# Altium schematic sheet lab_1_lyaptsev_usb_spi.SchDoc: =title_line_1 + title_line_2
size 420 x 297 mm; SheetNumber: 1; SheetTotal: 1
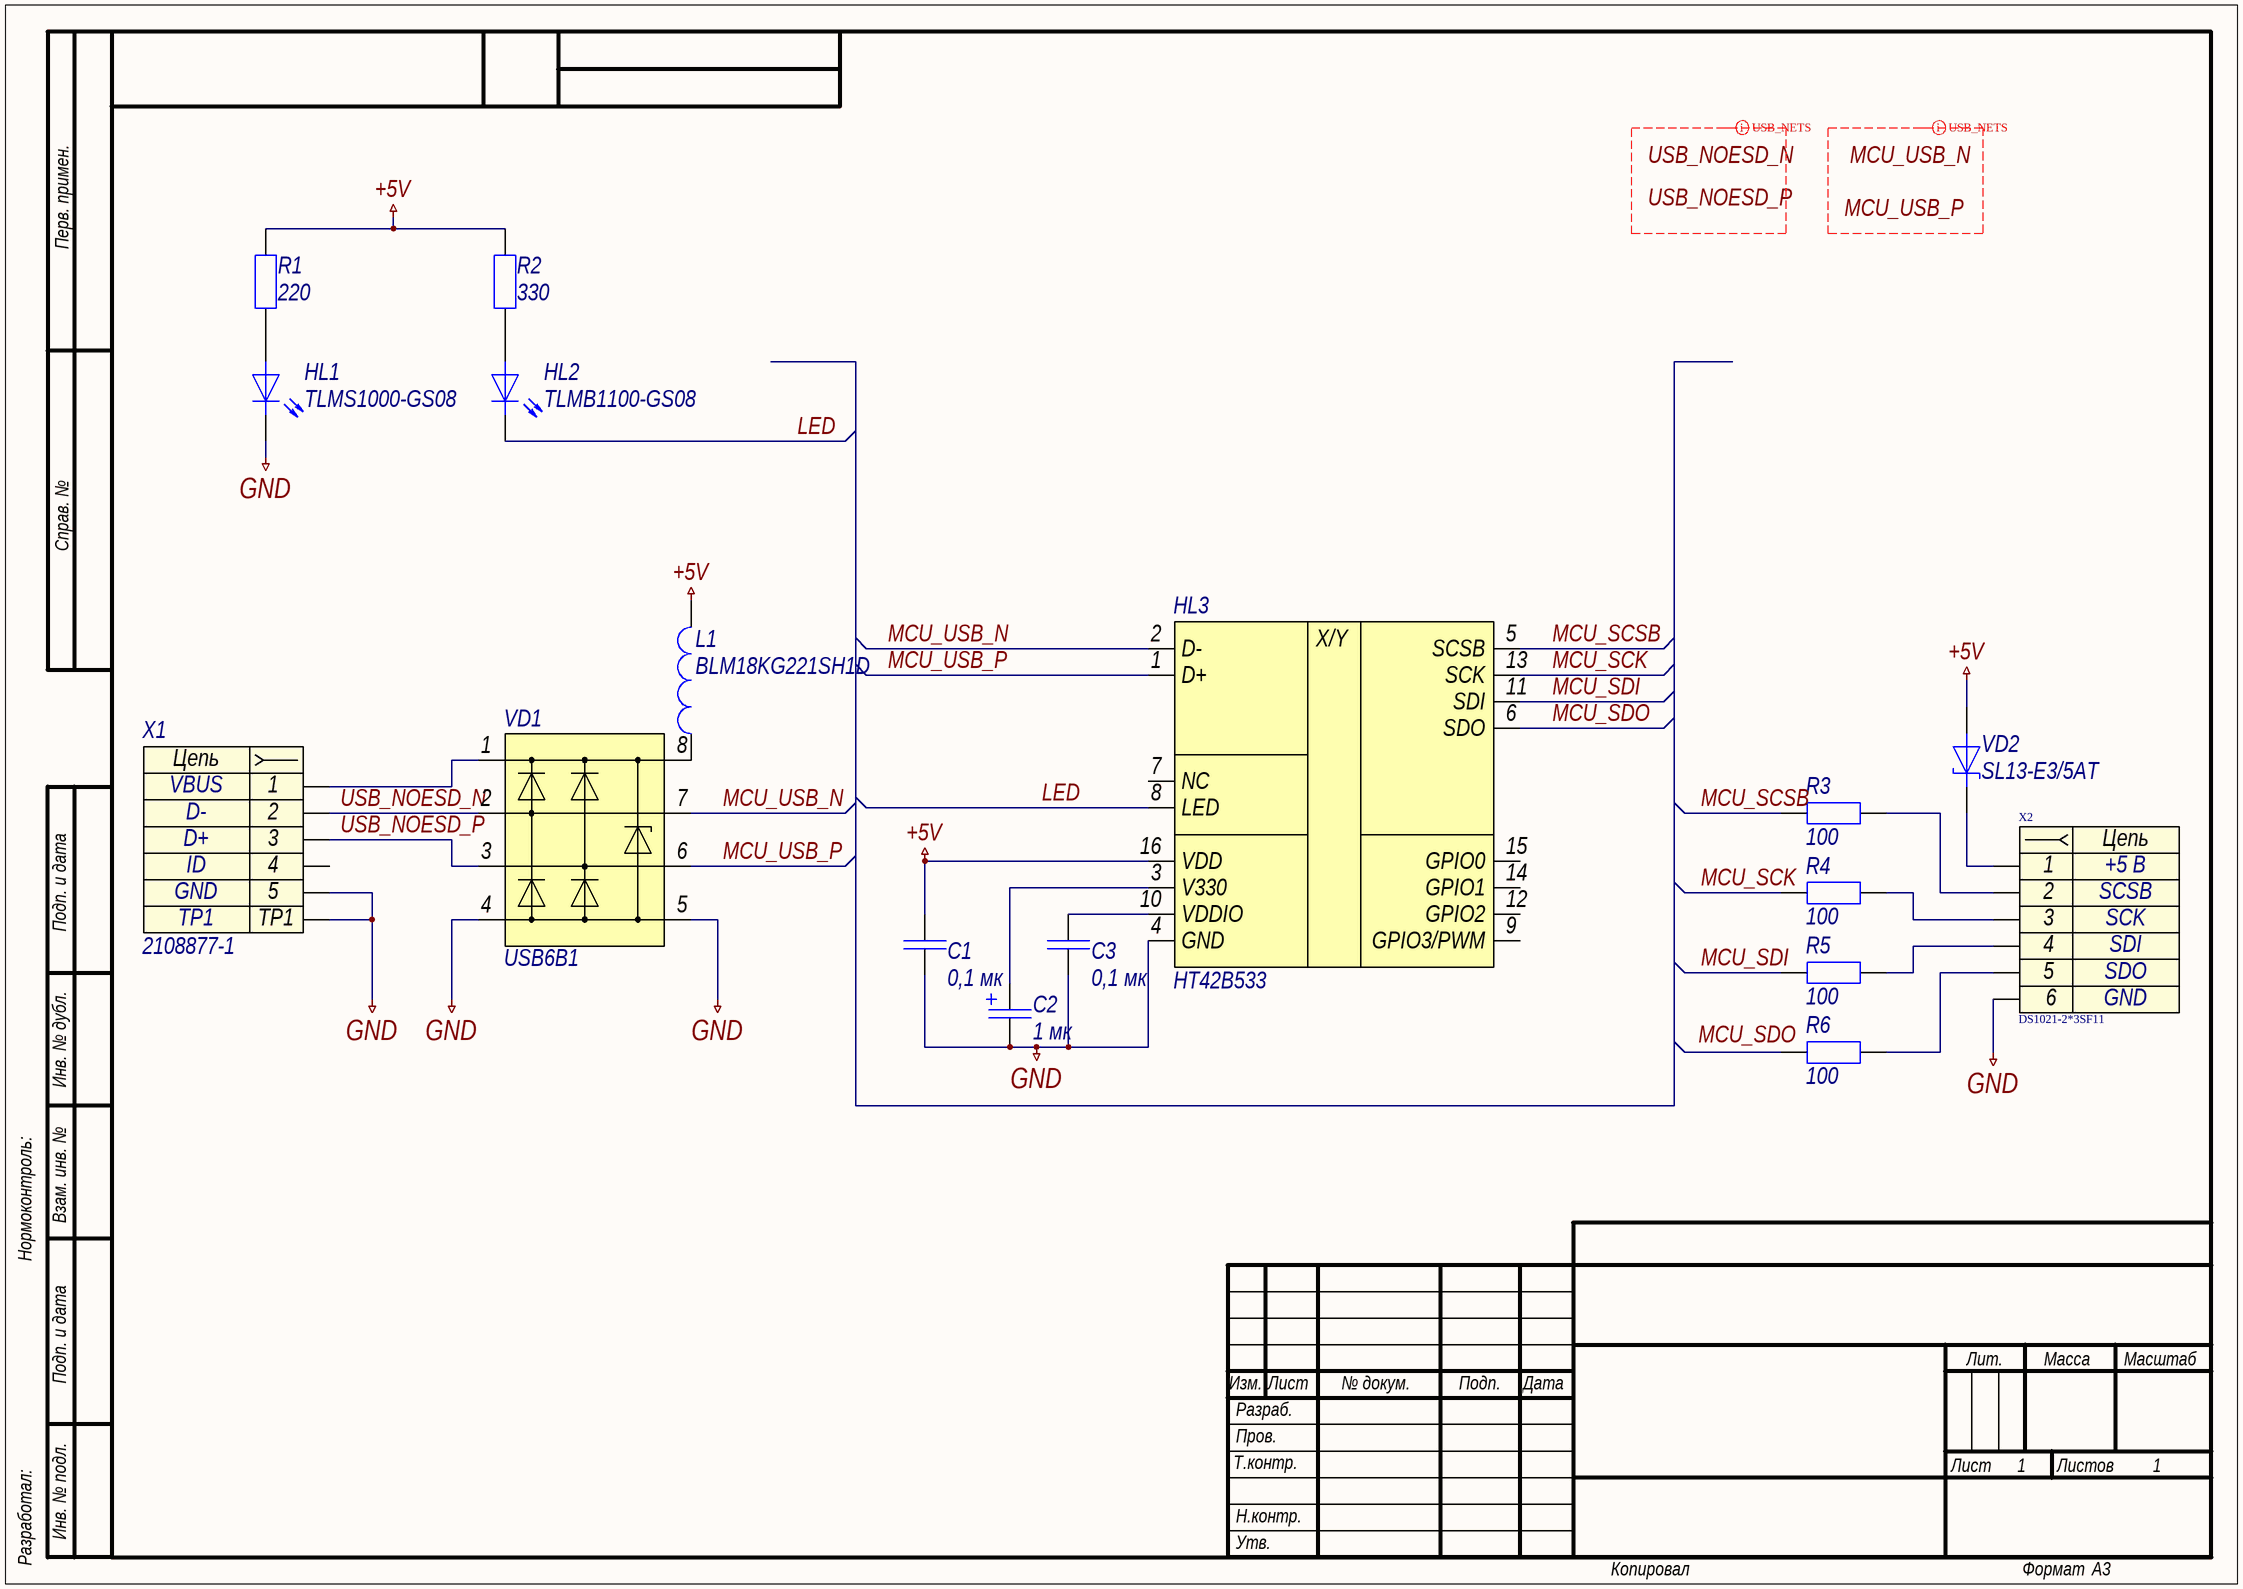
[diagram p0: lab_1_lyaptsev_usb_spi.SchDoc]

## Parts
C1  0,1 мк  [C0603]
C2  1 мк  [C1206POLAR]
C3  0,1 мк  [C0603]
HL1  TLMS1000-GS08  [HL0603]
HL2  TLMB1100-GS08  [HL0603]
HL3  HT42B533  [HT42B5-33]
L1  BLM18KG221SH1D  [FERRITE-BEAD]
R1  220  [R0603]
R2  330  [R0603]
R3  100  [R0603]
R4  100  [R0603]
R5  100  [R0603]
R6  100  [R0603]
VD1  USB6B1  [SO-8]
VD2  SL13-E3/5AT  [DO-214AC]
X1  2108877-1  [2108877-1]
X2  DS1021-2*3SF11  [PLS-2,54-2X3-THT-V]

## Nets
+5V: C1.2 HL3.16(VDD) L1.2 R1.2 R2.1 VD2.2
GND: C1.1 C2.2 C3.1 HL1.1 HL3.4(GND) VD1.4 VD1.5 X1.5 X1.TP1 X2.6
LED: HL2.1 HL3.8(LED)
MCU_SCK: HL3.13(SCK) R4.1
MCU_SCSB: HL3.5(SCSB) R3.1
MCU_SDI: HL3.11(SDI) R5.1
MCU_SDO: HL3.6(SDO)
MCU_USB_N: HL3.2(D-) VD1.7
MCU_USB_P: HL3.1(D+) VD1.6
USB_NOESD_N: VD1.2 X1.2
USB_NOESD_P: VD1.3 X1.3
NetC2_1: C2.1 HL3.3(V330)
NetC3_2: C3.2 HL3.10(VDDIO)
NetHL1_2: HL1.2 R1.1
NetHL2_2: HL2.2 R2.2
NetL1_1: L1.1 VD1.8
NetR3_2: R3.2 X2.2
NetR4_2: R4.2 X2.3
NetR5_2: R5.2 X2.4
NetR6_2: R6.2 X2.5
NetVD1_1: VD1.1 X1.1
NetVD2_1: VD2.1 X2.1

Not connected (* = marked no-connect by the designer): HL3 7(NC) 9(GPIO3/PWM) 12(GPIO2) 14(GPIO1) 15(GPIO0); R6 1; X1 4

## Layout directives
differential pair; rule Differential Pairs Routing [Pref Gap = 0.254mm    Min Gap  = 0.15mm    Max Gap  = 0.254mmPref Width = 0.381mm    Min Width  = 0.155mm    Max Width  = 0.381mm]; differential pair class USB_SIGNALS: MCU_USB_N, MCU_USB_P
differential pair; rule Differential Pairs Routing [Pref Gap = 0.254mm    Min Gap  = 0.15mm    Max Gap  = 0.254mmPref Width = 0.381mm    Min Width  = 0.155mm    Max Width  = 0.381mm]; differential pair class USB_SIGNALS_NOESD: USB_NOESD_N, USB_NOESD_P

## Notes on the sheet
- Labels drawn without touching a wire or pin: MCU_SDO, MCU_USB_N, MCU_USB_P, USB_NOESD_N, USB_NOESD_P
- Перв. примен.
- Справ. №
- Подп. и дата
- Инв. № дубл.
- Нормоконтроль:
- Взам. инв. №
- Изм.
- Лист
- № докум.
- Подп.
- Дата
- Лит.
- Масса
- Масштаб
- Т.контр.
- Пров.
- Разраб.
- Листов
- Разработал:
- Инв. № подл.
- Н.контр.
- Утв.
- Копировал
- Формат
- А3
- (in symbol dd0003) X/Y
- (in symbol x0001) Цепь
- (in symbol x0003) Цепь

## Library data of the parts
C1 C3 = c0002: =Описание; ID: c0002; Фамилия: Ларионов; Описание: Конденсатор чип 0603 0,1 мкФ 50 В ±5 %; Наименование: CC0603JRX7R9BB104; Производитель: Yageo; Отклонение: ±5 %; Номинальное напряжение: 50 В; Рабочие температуры: от -55 °С до +125 °С; Корпус: 0603; Номинал: 0,1 мк; HelpURL: https://www.yageo.com/upload/media/product/products/datasheet/mlcc/UPY-GPHC_X7R_6.3V-to-50V_20.pdf
C2 = c0008: =Описание; ID: c0008; Фамилия: Ларионов; Описание: Конденсатор чип 1206 1 мкФ 25 В ±10 % полярный; Наименование: 293D105X9025A2TE3; Производитель: Vishay Intertechnology, Inc.; Отклонение: ±10 %; Номинальное напряжение: 25 В; Рабочие температуры: от -55 °С до +125 °С; Корпус: 1206; Номинал: 1 мк; HelpURL: https://www.vishay.com/capacitors/list/product-40002/
HL1 = hl0001: =Описание; ID: hl0001; Фамилия: Ларионов; Описание: Светодиод чип 0603 красный; Производитель: Vishay Intertechnology, Inc.; Цвет: Red; Номинальная сила света: 4 мкд; Номинальная длина волны: 628 нм; Номинальный прямой ток: 15 мА; Номинальное падение напряжения: 1,8 В; Рассеиваемая мощность: 40 мВт; Рабочие температуры: от -40 °С до +100 °С; Корпус: 0603; Наименование: TLMS1000-GS08; HelpURL: https://www.vishay.com/leds/list/product-83172/
HL2 = hl0006: =Описание; ID: hl0006; Фамилия: Ларионов; Описание: Светодиод чип 0603 синий; Производитель: Vishay Intertechnology, Inc.; Цвет: Blue; Номинальная сила света: 5 мкд; Номинальная длина волны: 466 нм; Номинальный прямой ток: 30 мА; Номинальное падение напряжения: 3,9 В; Рассеиваемая мощность: 90 мВт; Рабочие температуры: от -40 °С до +100 °С; Корпус: 0603; Примечание: Not for new design; Наименование: TLMB1100-GS08; HelpURL: https://www.vishay.com/leds/list/product-83173/
HL3 = dd0003: =Описание; ID: dd0003; Фамилия: Ляпцев; Описание: Микросхема HT42B533; Производитель: Holtec; Наименование: HT42B533; Корпус: HT42B533; HelpURL: https://www.holtek.com/documents/10179/116711/HT42B533-xv120.pdf
L1 = l0001: =Описание; ID: l0001; Фамилия: Ларионов; Описание: Ферритовая бусина 220 Ом ±25 %; Производитель: Murata Manufacturing Co., Ltd.; Сопротивление, 100 МГц: 220 Ом; Отклонение, 100 Мгц: ±25 %; Сопротивление при постоянном токе: 0,05 Ом; Рабочие температуры: от -55 °С до +125 °С; Корпус: 0603; Наименование: BLM18KG221SH1D; HelpURL: https://www.murata.com/en-global/products/productdetail.aspx?partno=BLM18KG221SH1%23
R1 = r0005: =Описание; ID: r0005; Фамилия: Ларионов; Описание: Резистор чип 0603 220 Ом ±1 % 0,1 Вт; Наименование: RC0603FR-07220RL; Производитель: Yageo; Отклонение: ±1 %; Номинальное напряжение: 75 В; Рабочие температуры: от -55 °С до +155 °С; Номинальный ток: 1 А; Корпус: 0603; Номинал: 220; HelpURL: https://www.yageo.com/upload/media/product/productsearch/datasheet/rchip/PYu-RC_Group_51_RoHS_L_11.pdf
R2 = r0006: =Описание; ID: r0006; Фамилия: Ларионов; Описание: Резистор чип 0603 330 Ом ±1 % 0,1 Вт; Наименование: RC0603FR-07330RL; Производитель: Yageo; Отклонение: ±1 %; Номинальное напряжение: 75 В; Рабочие температуры: от -55 °С до +155 °С; Номинальный ток: 1 А; Корпус: 0603; Номинал: 330; HelpURL: https://www.yageo.com/upload/media/product/productsearch/datasheet/rchip/PYu-RC_Group_51_RoHS_L_11.pdf
R3-R6 = r0004: =Описание; ID: r0004; Фамилия: Самарин; Описание: Резистор чип 0603 100 Ом ±1 % 0,1 Вт; Наименование: RC0603FR‍‐07100RL; Производитель: Yageo; Отклонение: ±1 %; Номинальное напряжение: 75 В; Рабочие температуры: от -55 °С до +155 °С; Номинальный ток: 1 А; Корпус: 0603; Номинал: 100; HelpURL: https://www.yageo.com/upload/media/product/productsearch/datasheet/rchip/PYu-RC_Group_51_RoHS_L_11.pdf
VD1 = vd0004: =Описание; ID: vd0004; Фамилия: Ларионов; Описание: Диодная сборка для подавления помех, от 6 В; Производитель: STMicroelectronics; Наименование: USB6B1; Корпус: SO-8; HelpURL: https://www.st.com/content/st_com/en/products/protection-devices/esd-protection/usb-port-protection/usb6b1.html
VD2 = vd0001: =Описание; ID: vd0001; Фамилия: Ларионов; Описание: Диод Шоттки 30 В 1,5 А; Производитель: Vishay Intertechnology, Inc.; Пиковое прямое напряжение: 0,445 В; Импульсное обратное напряжение: 30 В; Макс# допустимый средний прямой ток: 1,5 А; Рабочие температуры: от -55 °С до +125 °С; Наименование: SL13-E3/5AT; Корпус: DO-214AC; HelpURL: https://www.vishay.com/product?docid=88740
X1 = x0001: Contact_1: VBUS; Contact_2: D-; Contact_3: D+; Contact_4: ID; Contact_5: GND; ID: x0001; Фамилия: Ларионов; Описание: USB 2.0 Micro USB Type B IP68 гнездо прямой угол; Производитель: TE Connectivity; Наименование: 2108877-1; HelpURL: https://www.te.com/global-en/product-2108877-1.html
X2 = x0003: Contact_1: +5 В; Contact_2: SCSB; Contact_4: SDI; Contact_5: SDO; Contact_3: SCK; Contact_6: GND; ID: x0003; Фамилия: Ляпцев; Описание: PLS 6-ти контактный прямой двухрядный (2,54 мм); Производитель: Connfly Electronic Co. LTD; Наименование: DS1021-2*3SF11; HelpURL: http://www.connfly.com/userfiles/image/UpLoadFile/File/2015/1/29/DS1021.pdf